# EAGLE design Controller (EAGLE 9.5.1)
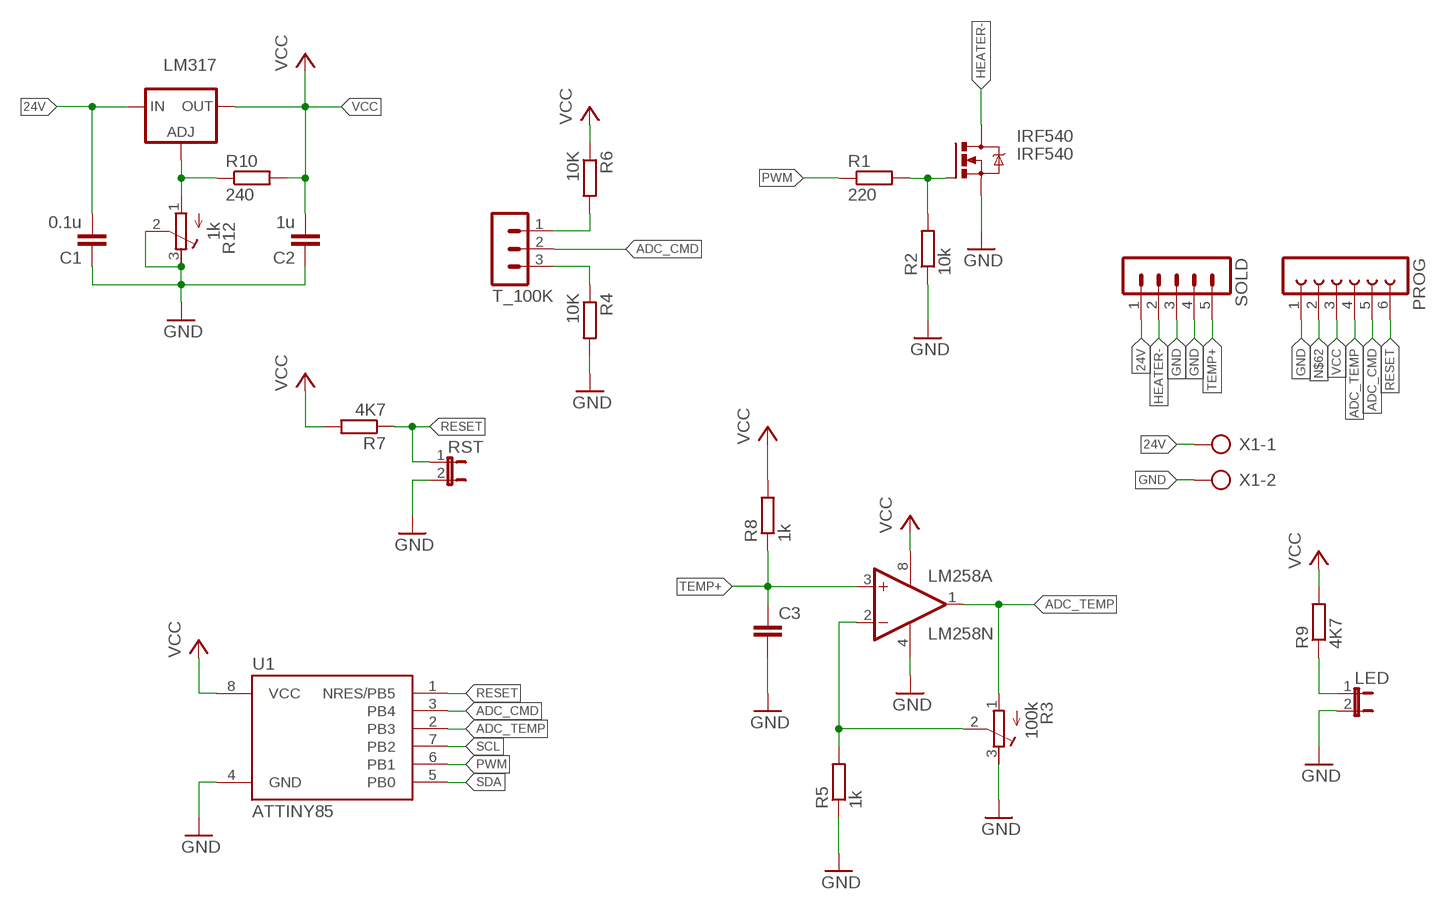
[diagram p0: schematic, sheet 1]

## Parts
C1  0.1u  C-EU025-025X050  [C025-025X050]
C2  1u  C-EU025-025X050  [C025-025X050]
C3  C-EU025-025X050  [C025-025X050]
IRF540  IRF540  [TO220BV]
LED  JP1E  [JP1]
LM258  LM258N  LM2903N  [DIL08]
LM317  LM317TS  [317TS]
PROG  FE06-1  [FE06]
R1  220  R-EU_0204/7  [0204/7]
R2  10k  R-EU_0204/7  [0204/7]
R3  100k  R-TRIMM64W  [RTRIM64W]
R4  10K  R-EU_0204/2V  [0204V]
R5  1k  R-EU_0204/7  [0204/7]
R6  10K  R-EU_0204/7  [0204/7]
R7  4K7  R-EU_0204/7  [0204/7]
R8  1k  R-EU_0204/7  [0204/7]
R9  4K7  R-EU_0204/7  [0204/7]
R10  240  R-EU_0204/7  [0204/7]
R12  1k  R-TRIMM64W  [RTRIM64W]
RST  JP1E  [JP1]
SOLD  MA05-1  [MA05-1]
T_100K  MA03-1  [MA03-1]
U1  ATTINY85  ATTINY85-P  [PDIP08_300MIL]
X1  SMKDSP_1,5/2  [SMKDSP_1,5/2]

## Nets
24V: C1.2 LM317.3(IN) SOLD.1 X1.1
ADC_CMD: PROG.5 R6.2 T_100K.1 T_100K.2 U1.3(PB4)
ADC_TEMP: LM258.1(A:OUT) PROG.4 R3.1(A) U1.2(PB3)
GND: C1.1 C2.1 C3.2 IRF540.S LED.2 LM258.4(P:V-) PROG.1 R2.1 R3.3(E) R4.2 R5.1 R12.2(S) R12.3(E) RST.2 SOLD.3 SOLD.4 U1.4(GND) X1.2
HEATER-: IRF540.D SOLD.2
N$1: IRF540.G R1.2 R2.2
N$3: LM258.2(A:-IN) R3.2(S) R5.2
N$61: LED.1 R9.1
N$62: PROG.2
N$67: LM317.1(ADJ) R10.1 R12.1(A)
N$72: R4.1 T_100K.3
PWM: R1.1 U1.6(PB1)
RESET: PROG.6 R7.1 RST.1 U1.1(NRES/PB5)
SCL: U1.7(PB2)
SDA: U1.5(PB0)
TEMP+: C3.1 LM258.3(A:+IN) R8.1 SOLD.5
VCC: C2.2 LM258.8(P:V+) LM317.2(OUT) PROG.3 R6.1 R7.2 R8.2 R9.2 R10.2 U1.8(VCC)
Unconnected: LM258.5(B:+IN) LM258.6(B:-IN) LM258.7(B:OUT)

## Library data of the parts
C1-C3 = rcl:C-EU: CAPACITOR, European symbol; SPICEPREFIX: C
IRF540 = transistor-power:IRF540: HEXFET Power MOSFET
LED RST = jumper:JP1E: JUMPER
LM258 = linear:LM2903: COMPARATOR
LM317 = v-reg:LM317TS: VOLTAGE REGULATOR
PROG = con-lsta:FE06-1: FEMALE HEADER; OC_FARNELL: unknown; OC_NEWARK: unknown
R1 R2 R4-R10 = rcl:R-EU_: RESISTOR, European symbol; SPICEPREFIX: R
R3 R12 = rcl:R-TRIMM: Trimm resistor; SPICEMODEL: X; SPICEPREFIXL: POT
SOLD = con-lstb:MA05-1: PIN HEADER; OC_FARNELL: unknown; OC_NEWARK: unknown
T_100K = con-lstb:MA03-1: PIN HEADER; OC_FARNELL: unknown; OC_NEWARK: unknown
U1 = _hhn_attiny25_45_85:ATTINY85*: ATMEL ATtiny 85 Packages: P = PDIP 08 30mil S = SOIC 08 EIAJ 208mil Technologies Note: for complete ordering code (temp. range, finish, tape&reel etc.) see www.atmel.com • Supply Voltage: V = (1.8…5.5)V | [blank] = (2.7…5.5)V • Speed: 10 = 10 MHz | 20 = 20 MHz Author: Dipl.-Ing. FH Rainer Bayer HHN Hochschule Heilbronn (Heilbronn University), rainer.bayer@hs-heilbronn.de Ingenieurbüro ing-rb, mail@ing-rb.de
X1 = con-phoenix-smkdsp:SMKDSP_1,5/2: Printklemme, Nennstrom: 17,5 A, Bemessungsspannung: 250 V, Raster: 5,0 mm Source: http://eshop.phoenixcontact.de .. 1733415.pdf; MF: FARNELL; MPN: 1733570; OC_FARNELL: 3041244; OC_NEWARK: 69C8588

## Board
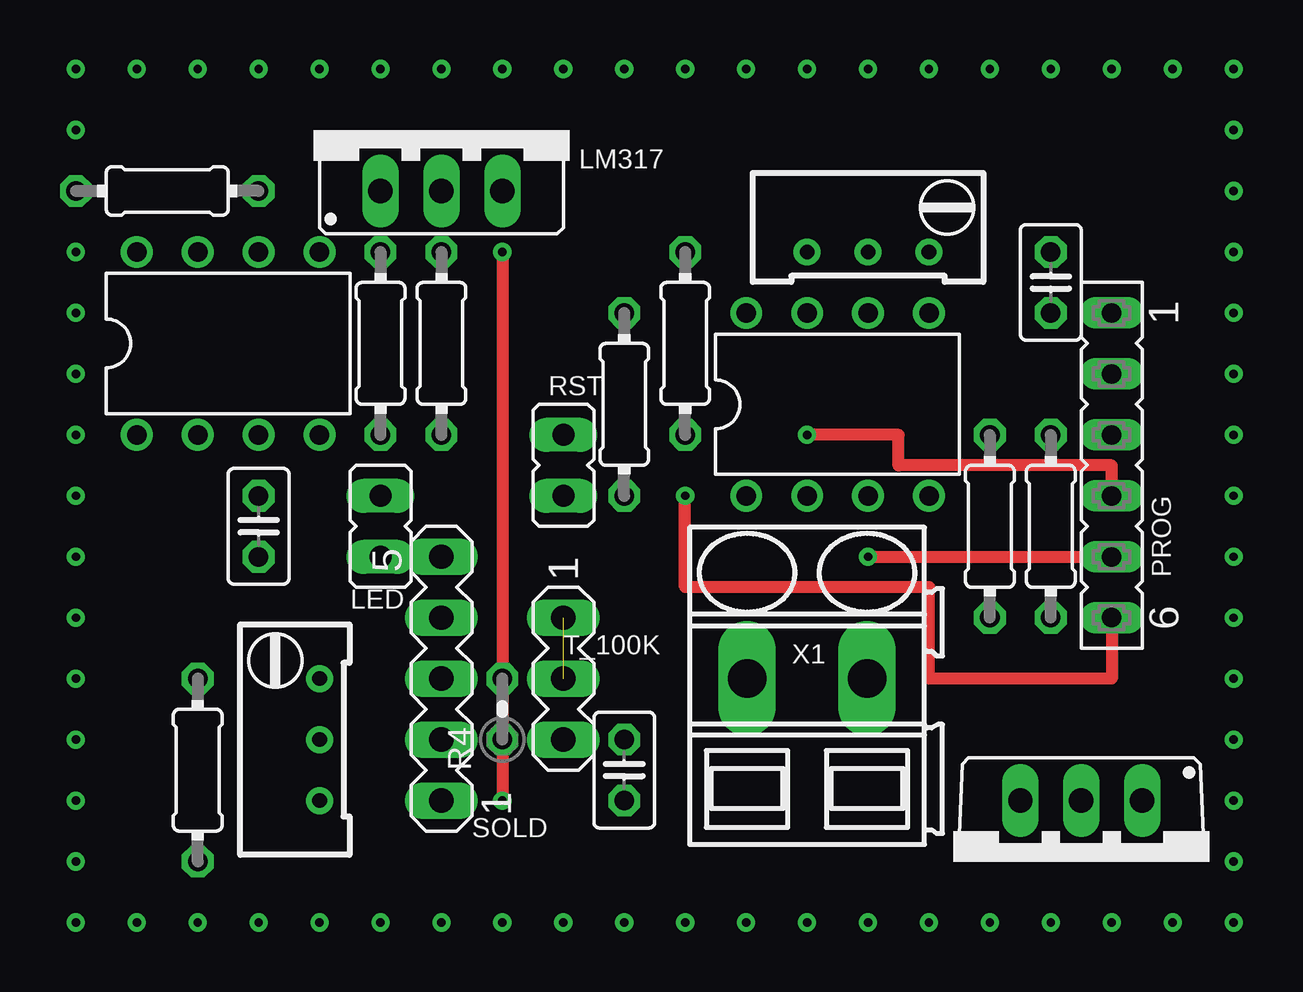
[diagram p1: board, top side]
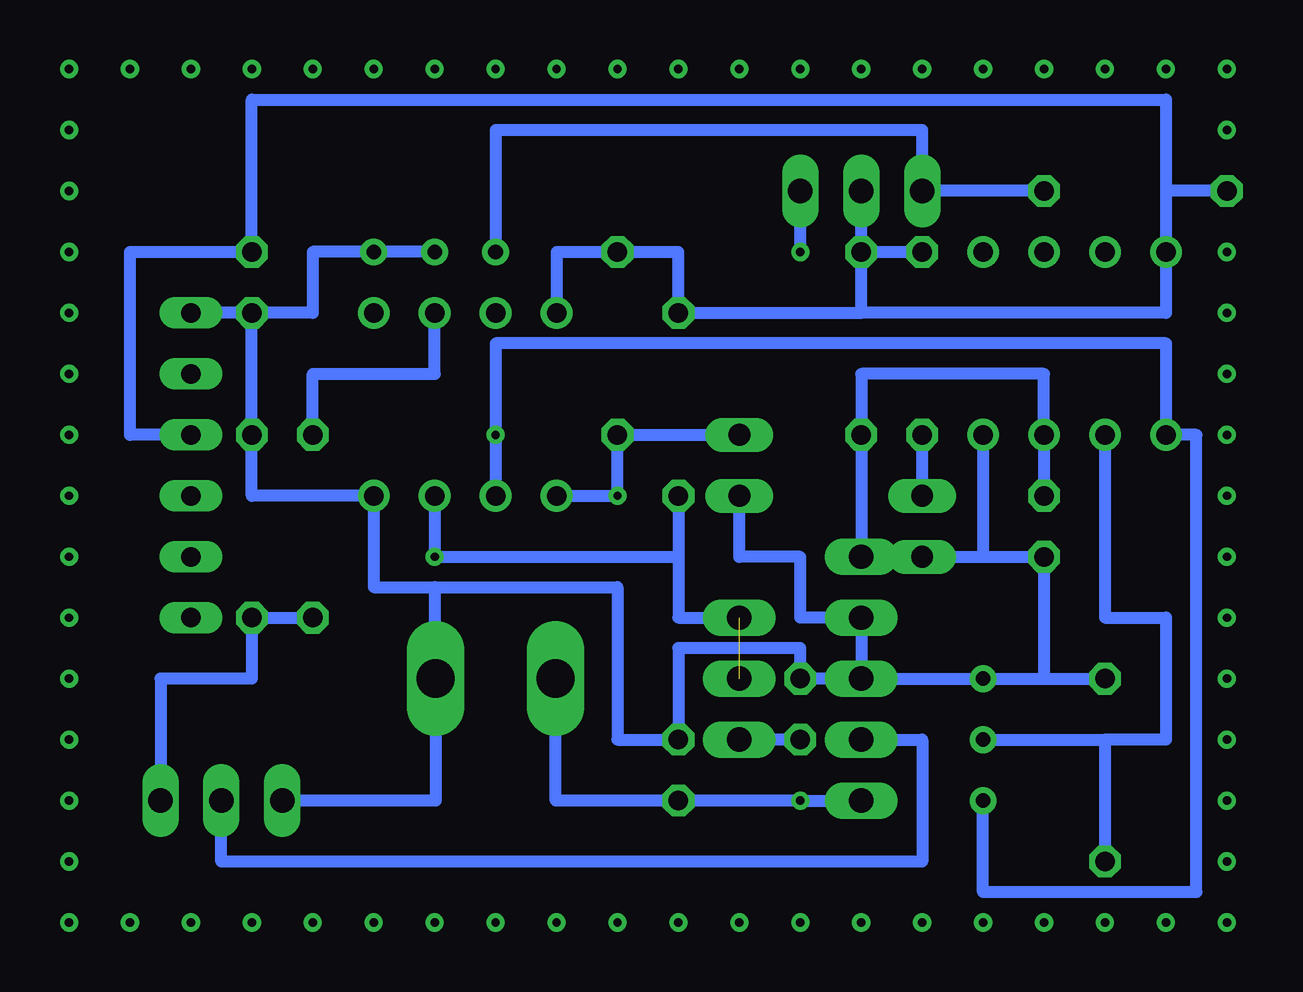
[diagram p2: board, bottom side, seen from below]

No outline drawn. Coordinates in mm, seen from the top.
Copper layers (1*16): Top 0.035mm / dielectric 1.5mm / Bottom 0.035mm
Design rules "default": minimum track width 6mil, minimum drill 0.35mm, track to track 6mil, track to pad 6mil, pad to pad 6mil, via to via 6mil, smd to smd 6mil, copper to edge 40mil, drill to drill 6mil, minimum pad ring 10mil, minimum via ring 8mil, stop-mask expansion 4mil, vias tented up to drill 0mil, thermal gap 10mil

### Footprints (pad centres in the part's own frame; a part is rotated, then mirrored left to right if it is on the bottom)
C025-025X050 = drill 0.813 octagon: 1 -1.27,0; 2 1.27,0
TO220BV = drill 1.016 long: D 0,-2.54; G -2.54,-2.54; S 2.54,-2.54
JP1 = drill 0.914 long: 1 0,-1.27; 2 0,1.27
DIL08 = drill 0.813 pad 1.27: 1 -3.81,-3.81; 2 -1.27,-3.81; 3 1.27,-3.81; 4 3.81,-3.81; 5 3.81,3.81; 6 1.27,3.81; 7 -1.27,3.81; 8 -3.81,3.81
317TS = drill 1.016 long: 1 -2.54,-2.54; 2 0,-2.54; 3 2.54,-2.54
FE06 = drill 0.813 long: 1 -6.35,0; 2 -3.81,0; 3 -1.27,0; 4 1.27,0; 5 3.81,0; 6 6.35,0
0204/7 = drill 0.813 octagon: 1 -3.81,0; 2 3.81,0
RTRIM64W = drill 0.61: 1 1.27,-2.54; 2 1.27,0; 3 1.27,2.54
0204V = drill 0.813 octagon: 1 -1.27,0; 2 1.27,0
MA05-1 = drill 1.016 long: 1 -5.08,0; 2 -2.54,0; 3 0,0; 4 2.54,0; 5 5.08,0
MA03-1 = drill 1.016 long: 1 -2.54,0; 2 0,0; 3 2.54,0
PDIP08_300MIL = drill 0.813: 1 -3.81,-3.81; 2 -1.27,-3.81; 3 1.27,-3.81; 4 3.81,-3.81; 5 3.81,3.81; 6 1.27,3.81; 7 -1.27,3.81; 8 -3.81,3.81
SMKDSP_1,5/2 = drill 1.6 pad 1.8 long: 1 -2.5,0; 2 2.5,0

### Placement (x,y rotation side)
C1  41.91,26.67 270 top
C2  59.69,46.99 90 top
C3  26.67,36.83 270 top
IRF540  60.96,22.86 180 top
LED  31.75,36.83 180 top
LM258  25.4,44.45 0 top
LM317  34.29,53.34 0 top
PROG  62.23,39.37 270 top
R1  57.15,36.83 270 top
R2  59.69,36.83 270 top
R3  27.94,27.94 0 top
R4  36.83,29.21 90 top
R5  24.13,26.67 270 top
R6  41.91,41.91 270 top
R7  44.45,44.45 90 top
R8  34.29,44.45 90 top
R9  31.75,44.45 90 top
R10  22.86,50.8 180 top
R12  52.07,49.53 270 top
RST  39.37,39.37 180 top
SOLD  34.29,30.48 90 top
T_100K  39.37,30.48 270 top
U1  50.8,41.91 0 top
X1  49.53,30.48 0 top

### Tracks (layer width: path | path; a pad name or v marks a point on that pad's centre or on a via)
24V  (via drill 0.35)
  Top 0.508: v36.83,48.26 v36.83,25.4
  Bottom 0.508: SOLD.1 v36.83,25.4 C1.2 47.03,25.4 X1.1 | v36.83,48.26 LM317.3
ADC_CMD  (via drill 0.35)  (1 unrouted)
  Top 0.508: v52.07,35.56 PROG.5
  Bottom 0.508: U1.3 v52.07,35.56 41.91,35.56 | T_100K.1 41.91,33.02 41.91,35.56 | R6.2 41.91,35.56
ADC_TEMP  (via drill 0.35)
  Top 0.508: PROG.4 62.23,39.37 53.34,39.37 53.34,40.64 v49.53,40.64
  Bottom 0.508: U1.2 v49.53,40.64 49.53,44.45 21.59,44.45 LM258.1 20.32,40.64 20.32,21.59 29.21,21.59 R3.1
GND
  Bottom 0.508: 52.07,34.29 52.07,30.48 X1.2 52.03,25.4 IRF540.S | 26.67,30.48 R3.3 SOLD.3 | 26.67,30.48 R5.1 | SOLD.3 SOLD.4 36.83,33.02 36.83,35.56 39.37,35.56 RST.2 | 52.07,34.29 54.61,34.29 U1.4 59.69,38.1 R2.1 C2.1 | 52.07,34.29 44.45,34.29 44.45,27.94 C1.1 41.91,31.75 36.83,31.75 R4.2 SOLD.3 | 26.67,30.48 C3.2 29.21,35.56 | LM258.4 29.21,35.56 | C2.1 PROG.1 | R12.2 R12.3 57.15,48.26 57.15,45.72 C2.1 | LED.2 29.21,35.56
HEATER-
  Bottom 0.508: SOLD.2 31.75,27.94 31.75,22.86 60.96,22.86 IRF540.D
N$1
  Bottom 0.508: R1.2 R2.2 59.69,30.48 63.5,30.48 IRF540.G
N$2  (via drill 0.35)
  other vias: 34.29,20.32
N$3
  Bottom 0.508: R3.2 24.13,27.94 | 24.13,27.94 R5.2 | 24.13,27.94 21.59,27.94 21.59,33.02 24.13,33.02 LM258.2
N$4  (via drill 0.35)
  other vias: 36.83,20.32
N$5  (via drill 0.35)
  other vias: 39.37,20.32
N$6  (via drill 0.35)
  other vias: 41.91,20.32
N$7  (via drill 0.35)
  other vias: 44.45,20.32
N$8  (via drill 0.35)
  other vias: 46.99,20.32
N$9  (via drill 0.35)
  other vias: 49.53,20.32
N$10  (via drill 0.35)
  other vias: 52.07,20.32
N$11  (via drill 0.35)
  other vias: 54.61,20.32
N$12  (via drill 0.35)
  other vias: 57.15,20.32
N$13  (via drill 0.35)
  other vias: 62.23,20.32
N$14  (via drill 0.35)
  other vias: 67.31,22.86
N$15  (via drill 0.35)
  other vias: 67.31,25.4
N$16  (via drill 0.35)
  other vias: 67.31,27.94
N$17  (via drill 0.35)
  other vias: 67.31,30.48
N$18  (via drill 0.35)
  other vias: 67.31,33.02
N$19  (via drill 0.35)
  other vias: 67.31,35.56
N$20  (via drill 0.35)
  other vias: 67.31,38.1
N$21  (via drill 0.35)
  other vias: 67.31,40.64
N$22  (via drill 0.35)
  other vias: 67.31,43.18
N$23  (via drill 0.35)
  other vias: 67.31,45.72
N$24  (via drill 0.35)
  other vias: 67.31,48.26
N$25  (via drill 0.35)
  other vias: 19.05,53.34
N$26  (via drill 0.35)
  other vias: 19.05,55.88
N$27  (via drill 0.35)
  other vias: 21.59,55.88
N$28  (via drill 0.35)
  other vias: 24.13,55.88
N$29  (via drill 0.35)
  other vias: 26.67,55.88
N$30  (via drill 0.35)
  other vias: 29.21,55.88
N$31  (via drill 0.35)
  other vias: 31.75,55.88
N$32  (via drill 0.35)
  other vias: 34.29,55.88
N$33  (via drill 0.35)
  other vias: 36.83,55.88
N$34  (via drill 0.35)
  other vias: 39.37,55.88
N$35  (via drill 0.35)
  other vias: 41.91,55.88
N$36  (via drill 0.35)
  other vias: 44.45,55.88
N$37  (via drill 0.35)
  other vias: 46.99,55.88
N$38  (via drill 0.35)
  other vias: 49.53,55.88
N$39  (via drill 0.35)
  other vias: 52.07,55.88
N$40  (via drill 0.35)
  other vias: 54.61,55.88
N$41  (via drill 0.35)
  other vias: 57.15,55.88
N$42  (via drill 0.35)
  other vias: 19.05,48.26
N$43  (via drill 0.35)
  other vias: 59.69,20.32
N$44  (via drill 0.35)
  other vias: 19.05,45.72
N$45  (via drill 0.35)
  other vias: 19.05,43.18
N$46  (via drill 0.35)
  other vias: 19.05,40.64
N$47  (via drill 0.35)
  other vias: 19.05,38.1
N$48  (via drill 0.35)
  other vias: 19.05,35.56
N$49  (via drill 0.35)
  other vias: 19.05,33.02
N$50  (via drill 0.35)
  other vias: 19.05,30.48
N$51  (via drill 0.35)
  other vias: 19.05,27.94
N$52  (via drill 0.35)
  other vias: 19.05,25.4
N$53  (via drill 0.35)
  other vias: 19.05,22.86
N$54  (via drill 0.35)
  other vias: 19.05,20.32
N$55  (via drill 0.35)
  other vias: 21.59,20.32
N$56  (via drill 0.35)
  other vias: 24.13,20.32
N$57  (via drill 0.35)
  other vias: 26.67,20.32
N$58  (via drill 0.35)
  other vias: 29.21,20.32
N$59  (via drill 0.35)
  other vias: 31.75,20.32
N$60  (via drill 0.35)
  other vias: 59.69,55.88
N$61
  Bottom 0.508: LED.1 R9.1
N$63  (via drill 0.35)
  other vias: 64.77,20.32
N$64  (via drill 0.35)
  other vias: 67.31,20.32
N$65  (via drill 0.35)
  other vias: 62.23,55.88
N$66  (via drill 0.35)
  other vias: 64.77,55.88
N$67
  Bottom 0.508: R10.1 LM317.1 31.75,53.34 49.53,53.34 R12.1
N$68  (via drill 0.35)
  other vias: 67.31,55.88
N$69  (via drill 0.35)
  other vias: 67.31,53.34
N$70  (via drill 0.35)
  other vias: 67.31,50.8
N$72
  Bottom 0.508: R4.1 T_100K.3
PWM
  Bottom 0.508: R1.1 57.15,43.18 52.07,43.18 U1.6
RESET  (via drill 0.35)
  Top 0.508: PROG.6 62.23,30.48 54.61,30.48 54.61,34.29 44.45,34.29 v44.45,38.1
  Bottom 0.508: U1.1 v44.45,38.1 R7.1 RST.1
TEMP+
  Bottom 0.508: C3.1 LM258.3 26.67,43.18 34.29,43.18 R8.1 SOLD.5
VCC
  Bottom 0.508: 34.29,45.72 21.59,45.72 LM258.8 21.59,50.8 | 34.29,45.72 R8.2 | PROG.3 64.77,40.64 64.77,48.26 C2.2 59.69,54.61 21.59,54.61 21.59,50.8 | U1.8 46.99,48.26 R7.2 41.91,48.26 R6.1 34.29,45.72 | R8.2 R9.2 | R8.2 LM317.2 | R10.2 21.59,50.8